# Altium project 3083 audio amp.PrjPcb
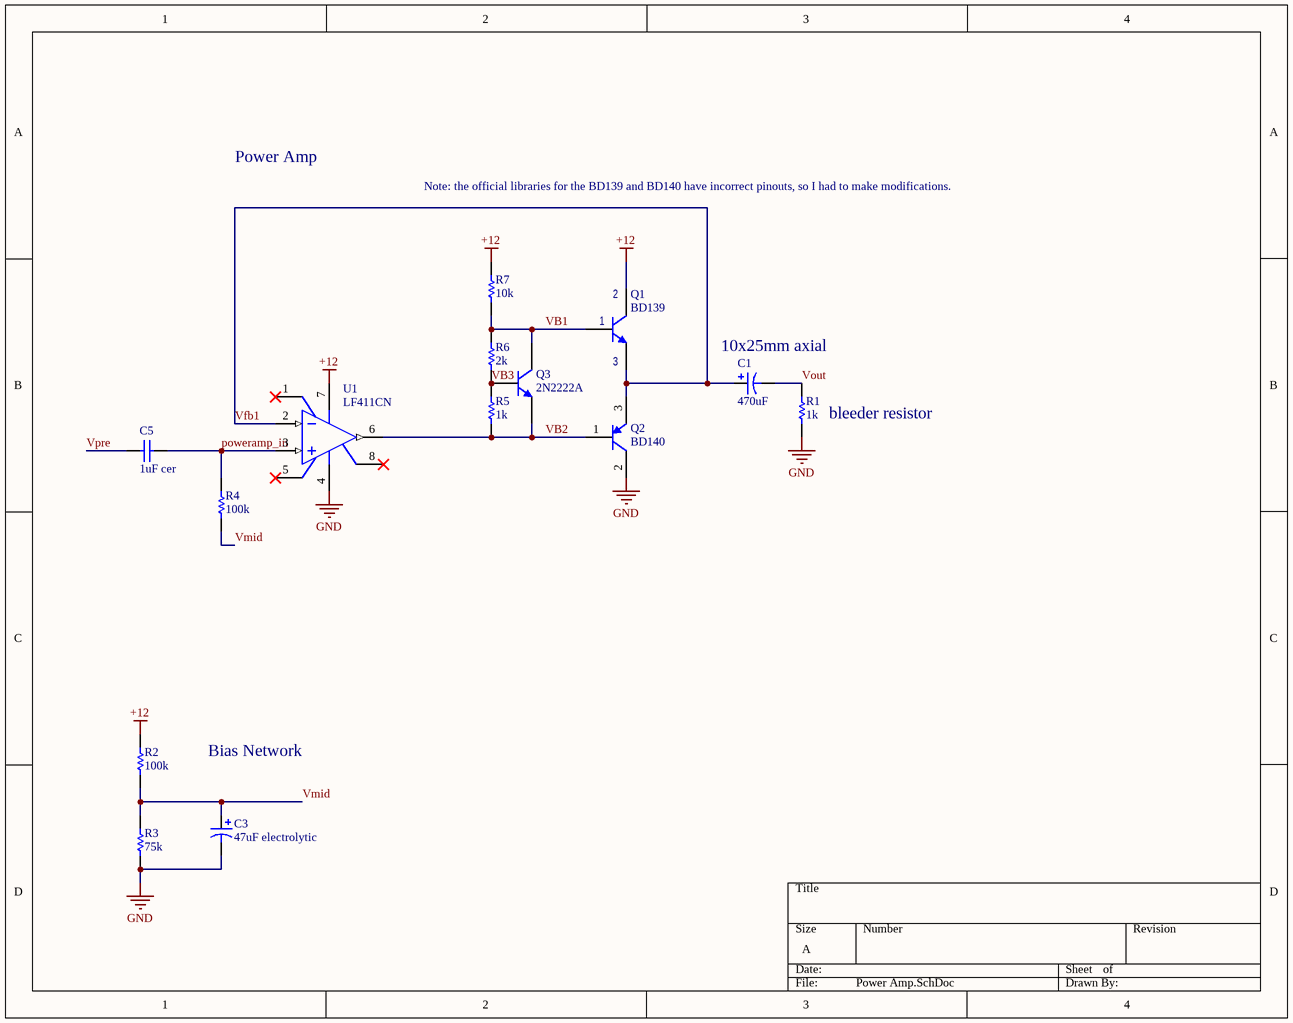
[diagram p0: Power Amp.SchDoc]
3 sheets, 31 parts. Net scope: global (net labels, ports and power ports of the same name join across sheets).
Sheets:
  Power Amp.SchDoc
  Preamp.SchDoc
  Connections.SchDoc

## Sheet Power Amp.SchDoc
size A; DrawnBy: William Meng

### Parts
C1  470uF  [Capacitor]
C3  47uF electrolytic  [PCB-bs2nfpedd8vjo8odb39w-1]
C5  1uF cer  [PCB-19304320-1]
Q1  BD139  [PCB-vxsgokorrilsux2zr6a3-1]
Q2  BD140  [ONSC-TO-225-3-77-09]
Q3  2N2222A  [PCB-il5alzs33b9y8p1mx0ke-1]
R1  1k  [PCB-ufx52wqpb97u1085hkka-1]
R2  100k  [PCB-ufx52wqpb97u1085hkka-1]
R3  75k  [PCB-ufx52wqpb97u1085hkka-1]
R4  100k  [PCB-ufx52wqpb97u1085hkka-1]
R5  1k  [PCB-ufx52wqpb97u1085hkka-1]
R6  2k  [PCB-ufx52wqpb97u1085hkka-1]
R7  10k  [PCB-ufx52wqpb97u1085hkka-1]
U1  LF411CN  [N08E]

### Nets
+12: Q1.2(C) R2.2 R7.2 U1.7(V+)
GND: C3.2 Q2.2(C) R1.1 R3.1 U1.4(V-)
poweramp_in: C5.2 R4.2 U1.3(IN+)
VB1: Q1.1(B) Q3.3(C) R6.2 R7.1
VB2: Q2.1(B) Q3.1(E) R5.1 U1.6(OUT)
VB3: Q3.2(B) R5.2 R6.1
Vfb1: C1.1 Q1.3(E) Q2.3(E) U1.2(IN-)
Vmid: C3.1 R2.1 R3.2 R4.1
Vout: C1.2 R1.2
Vpre: C5.1

Not connected (* = marked no-connect by the designer): U1 1(BAL)* 5(BAL)* 8(NC)*

### Notes on the sheet
- Power Amp
- Note: the official libraries for the BD139 and BD140 have incorrect pinouts, so I had to make modifications.
- 10x25mm axial
- (near R1) bleeder resistor
- Bias Network

### Library data of the parts
C1 = CMP-76c7be02e5fba900-1: Cap Aluminum 33uF 100V 20% (10 X 25mm) Axial 3.4 Ohm 140mA 4000h 125°C T/R; OctopartID: 76c7be02e5fba900
C3 = EEU-FC1H470: Cap Aluminum Lytic 47uF 50V 20% (6.3 X 11.2mm) Radial 2.5mm 260mA 1000h 105C Automotive Bulk; Capacitance: 47.0 F; Dielectric Material: Aluminum Electrolytic; Voltage Rating (DC): 50.0 V; Lead-Free Status: Lead Free; Mounting Style: Through Hole; Lifecycle Status: Not Listed by Manufacturer; Manufacturer Part Number: EEU-FC1H470; Packaging: Bulk; Capacitance Tolerance: ±20%; Number of Pins: 2; OctopartID: 6ed4a5842ea2b113; Size-Length: 11.2 mm; RoHS: Compliant; REACH SVHC Compliance: No SVHC; Size-Diameter: 6.30 mm; Octopart URL: http://octopart.com/eeu-fc1h470-panasonic-39478544; Size-Height: 11.2 mm
C5 = C330C105K5R5TA: Capacitor; Ceramic; Cap 1.00uF; Tol 10%; Radial; Vol-Rtg 50V; Lead-Free Status: Lead Free; Capacitance: 1.00 µF; Voltage Rating (DC): 50.0 V; Lead Length: 7.00 mm; Dielectric Characteristic: X7R; Size-Height: 9.14 mm; Number of Pins: 2; Mounting Style: Through Hole; OctopartID: bb267075e97664e1; REACH SVHC Compliance: No SVHC; Octopart URL: http://octopart.com/c330c105k5r5ta-kemet-39417654; Packaging: Bulk; Capacitance Tolerance: ±10%; Manufacturer Part Number: C330C105K5R5TA; Size-Length: 7.62 mm; RoHS: Compliant
Q1 = STMicroelectronics BD139-4: BD139 Series NPN 80 V 1.5 A Complementary Low Voltage Transistor - SOT-32
Q2 = BD140-3: Plastic Medium-Power Silicon PNP Transistor, 3-Pin TO-225, Bulk Box; Current Rating: 1.5 A; Lead-Free Status: Contains Lead; Voltage Rating (DC): -80.0 V; Manufacturer Part Number: BD140; Lifecycle Status: Not Listed by Manufacturer; Mounting Style: Through Hole; Octopart Url: https://octopart.com/bd140-on+semiconductor-354679; OctopartID: 29e8e0e765f9f62f; Packaging: Bulk; RoHS: Compliant
Q3 = P2N2222AG: Transistor, NPN, 40v, To-92; Lead-Free Status: Lead Free; Polarity: NPN, N-Channel; Voltage Rating (DC): 40.0 V; Octopart URL: https://octopart.com/p2n2222ag-on+semiconductor-55396558; Number of Pins: 3
R1-R7 = CFR50J10K: Through Hole Carbon Film Resistor, CFR Series, 10 kohm, 500 mW, - 5%, 350 V, Axial Leaded
U1 = LF411CN: Low Offset, Low Drift JFET Input Operational Amplifier, 8-pin MDIP; Bandwidth: 4000000.0 Hz; Input Offset Drift: 7e-06 V/K; Lead-Free Status: Contains Lead; Number of Channels: 1; Output Current: 0.025 A; Slew Rate: 15.0 V/μs; Supply Voltage (DC): 44.0 V; Case/Package: DIP; Gain Bandwidth Product: 4000000.0 Hz; Lifecycle Status: Active; Mounting Style: Through Hole; Number of Pins: 8; Octopart Url: https://octopart.com/lf411cn-texas+instruments-24728701; OctopartID: f68f3efc87942948; Packaging: Rail; REACH SVHC Compliance: No SVHC; RoHS: Non-Compliant; Manufacturer Part Number: LF411CN

## Sheet Preamp.SchDoc
size A
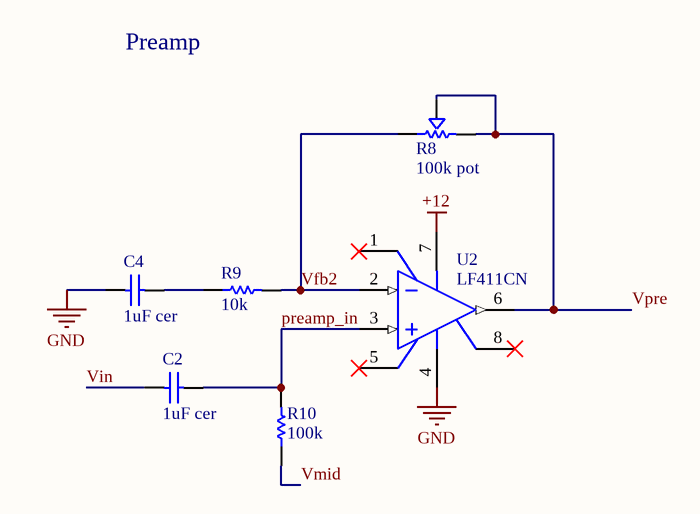
[diagram p1: Preamp.SchDoc]

### Parts
C2  1uF cer  [PCB-19304320-1]
C4  1uF cer  [PCB-19304320-1]
R8  100k pot  [PCB-urdemwrt71ubtqm2k8m7-1]
R9  10k  [PCB-ufx52wqpb97u1085hkka-1]
R10  100k  [PCB-ufx52wqpb97u1085hkka-1]
U2  LF411CN  [N08E]

### Nets
+12: U2.7(V+)
GND: C4.1 U2.4(V-)
preamp_in: C2.2 R10.2 U2.3(IN+)
Vfb2: R8.1 R9.2 U2.2(IN-)
Vin: C2.1
Vmid: R10.1
Vpre: R8.2 R8.3 U2.6(OUT)
NetC4_2: C4.2 R9.1

Not connected (* = marked no-connect by the designer): U2 1(BAL)* 5(BAL)* 8(NC)*

### Notes on the sheet
- Preamp

### Library data of the parts
C2 C4 = C330C105K5R5TA: as C5 on sheet Power Amp; Size-Height: 9.14 mm; Number of Pins: 2; Mounting Style: Through Hole; OctopartID: bb267075e97664e1; REACH SVHC Compliance: No SVHC; Octopart URL: http://octopart.com/c330c105k5r5ta-kemet-39417654; Packaging: Bulk; Capacitance Tolerance: ±10%; Manufacturer Part Number: C330C105K5R5TA; Size-Length: 7.62 mm; RoHS: Compliant
R8 = CMP-1209584-8: Res Conductive Plastic POT 50K Ohm 20% 1/4W 1Turn 3.18mm Pin Panel Mount/Through Hole; Manufacturer Part Number: 3310C-001-503L; Resistance: 50.0 kΩ; Lead-Free Status: Lead Free; Power Rating: 250 mW; Resistance Tolerance: ±20%; Size-Length: 9.52 mm; Octopart URL: http://octopart.com/3310c-001-503l-bourns-578521; OctopartID: f7063e0401b928c1; RoHS: Compliant
R9 R10 = CFR50J10K: as R1 on sheet Power Amp
U2 = LF411CN: as U1 on sheet Power Amp; Case/Package: DIP; Gain Bandwidth Product: 4000000.0 Hz; Lifecycle Status: Active; Mounting Style: Through Hole; Number of Pins: 8; Octopart Url: https://octopart.com/lf411cn-texas+instruments-24728701; OctopartID: f68f3efc87942948; Packaging: Rail; REACH SVHC Compliance: No SVHC; RoHS: Non-Compliant; Manufacturer Part Number: LF411CN

## Sheet Connections.SchDoc
size A
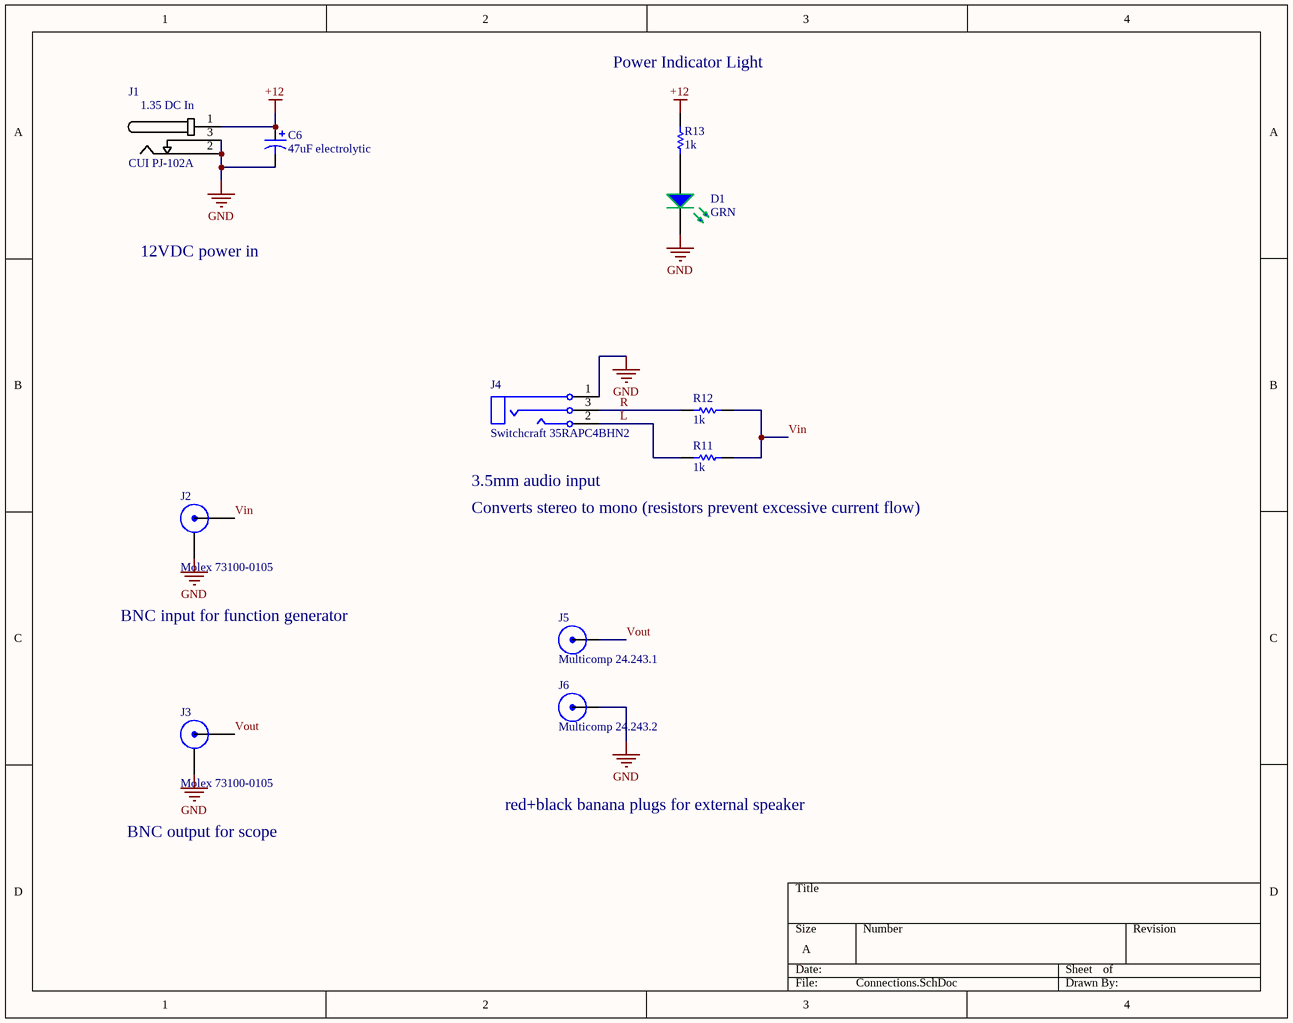
[diagram p2: Connections.SchDoc]

### Parts
C6  47uF electrolytic  [PCB-bs2nfpedd8vjo8odb39w-1]
D1  GRN  [PCBComponent_1]
J1  CUI PJ-102A  [PCBComponent_1 - duplicate]
J2  Molex 73100-0105  [PCB-581953-1]
J3  Molex 73100-0105  [PCB-581953-1]
J4  Switchcraft 35RAPC4BHN2  [PCB-329508-1]
J5  Multicomp 24.243.1  [PCB-1keg917tfggg2k36z9zw-1]
J6  Multicomp 24.243.2  [PCB-20399855-1]
R11  1k  [PCB-ufx52wqpb97u1085hkka-1]
R12  1k  [PCB-ufx52wqpb97u1085hkka-1]
R13  1k  [PCB-ufx52wqpb97u1085hkka-1]

### Nets
+12: C6.1 J1.1 R13.2
GND: C6.2 D1.2(K) J1.2 J1.3 J2.2 J3.2 J4.1(SLEEVE) J6.1
L: J4.2(TIP) R11.2
R: J4.3(RING) R12.2
Vin: J2.1 R11.1 R12.1
Vout: J3.1 J5.1
NetD1_1: D1.1(A) R13.1

### Notes on the sheet
- Power Indicator Light
- 12VDC power in
- (near J4) 3.5mm audio input
- (near R11) Converts stereo to mono (resistors prevent excessive current flow)
- BNC input for function generator
- BNC output for scope
- red+black banana plugs for external speaker
- (in symbol 1352) 1.35 DC In

### Library data of the parts
C6 = EEU-FC1H470: as C3 on sheet Power Amp; Mounting Style: Through Hole; Lifecycle Status: Not Listed by Manufacturer; Manufacturer Part Number: EEU-FC1H470; Packaging: Bulk; Capacitance Tolerance: ±20%; Number of Pins: 2; OctopartID: 6ed4a5842ea2b113; Size-Length: 11.2 mm; RoHS: Compliant; REACH SVHC Compliance: No SVHC; Size-Diameter: 6.30 mm; Octopart URL: http://octopart.com/eeu-fc1h470-panasonic-39478544; Size-Height: 11.2 mm
D1 = XVB1LUG50D: 5mm Lens, One Position CBI ; Emitting Color Green with Green Diffused Lens; Datasheet: https://www.sunledusa.com/products/spec/XVB1LUG50D.pdf; Color: Green; Manufacturer Part Number: XVB1LUG50D
J1 = 1352: FolioGadgets DC Jack; Manufacturer Part Number: B06XQ2JGQQ; OctopartID: 2700effd37adf8c7
J2 J3 = 73100-0105: 50 Ohms, BNC Right-Angle PCB Jack Receptacle, Nickel Plated Zinc Alloy Body, Low Profile; Gender: Female; RoHS: Compliant; Contact Material: Phosphor Bronze; Lifecycle Status: Active; Halogen Free Status: Not Reviewed; Orientation: Right Angle; Manufacturer Part Number: 73100-0105; OctopartID: fb98329907f8245f
J4 = 35RAPC4BHN2: CONN JACK STEREO 3.5MM HORIZON; Lead-Free Status: Lead Free; Cable Length: 0.014 m; Number of Contacts: 3; Gender: Male; Contact Plating: Silver; OctopartID: 0ad0c3daa371d517; Octopart Url: https://octopart.com/35rapc4bhn2-switchcraft-36039; REACH SVHC Compliance: No SVHC; RoHS: Compliant; Number of Positions: 3; Color: Black; Manufacturer Part Number: 35RAPC4BHN2
J5 = 24.243.1: Banana Test Connector, 4mm, Jack, PCB Mount, 20 A, 30 V, Silver Plated Contacts, Red; Current Rating: 20.0 A; Voltage Rating (DC): 30.0 V; Gender: Male; RoHS: Compliant; Octopart Url: https://octopart.com/24.243.1-multicomp-57101049; Contact Plating: Silver; OctopartID: 7431be5c1baeabf6; Contact Material: Brass; Manufacturer Part Number: 24.243.1; Size-Length: 0.024 m; REACH SVHC Compliance: No SVHC
J6 = 24.243.2: Banana Test Connector, 4mm, Jack, PCB Mount, 20 A, 30 V, Silver Plated Contacts, Black; Current Rating: 20.0 A; Gender: Male; Manufacturer Part Number: 24.243.2; Contact Plating: Silver; Contact Material: Brass; RoHS: Compliant; Octopart Url: https://octopart.com/24.243.2-multicomp-57101050; Size-Length: 0.024 m; OctopartID: d81d1270b78107da; REACH SVHC Compliance: No SVHC
R11-R13 = CFR50J10K: as R1 on sheet Power Amp

## Nets that join several sheets
+12: Power Amp (Q1.2 R2.2 R7.2 U1.7), Preamp (U2.7), Connections (C6.1 J1.1 R13.2)
GND: Power Amp (5 pins), Preamp (C4.1 U2.4), Connections (8 pins)
Vin: Preamp (C2.1), Connections (J2.1 R11.1 R12.1)
Vmid: Power Amp (C3.1 R2.1 R3.2 R4.1), Preamp (R10.1)
Vout: Power Amp (C1.2 R1.2), Connections (J3.1 J5.1)
Vpre: Power Amp (C5.1), Preamp (R8.2 R8.3 U2.6)